# Altium schematic sheet 780-00012-P1, Sch M2 Focus Drive.SchDoc
size B; PageSetup: Record=PageOptions|CenterHorizontal=True|CenterVertical=True|PrintScale=1.09|XCorrection=1.00|YCorrection=1.00|PrintKind=0|BorderSize=5000000|LeftOffset=0|BottomOffset=0|Orientation=2|PaperLength=1000|PaperWidth=1000|Scale=100|PaperSource=7|PrintQuality=-4|MediaType=1|DitherType=10|PaperKind=Tabloid 11 x 17in|PrintScaleMode=1
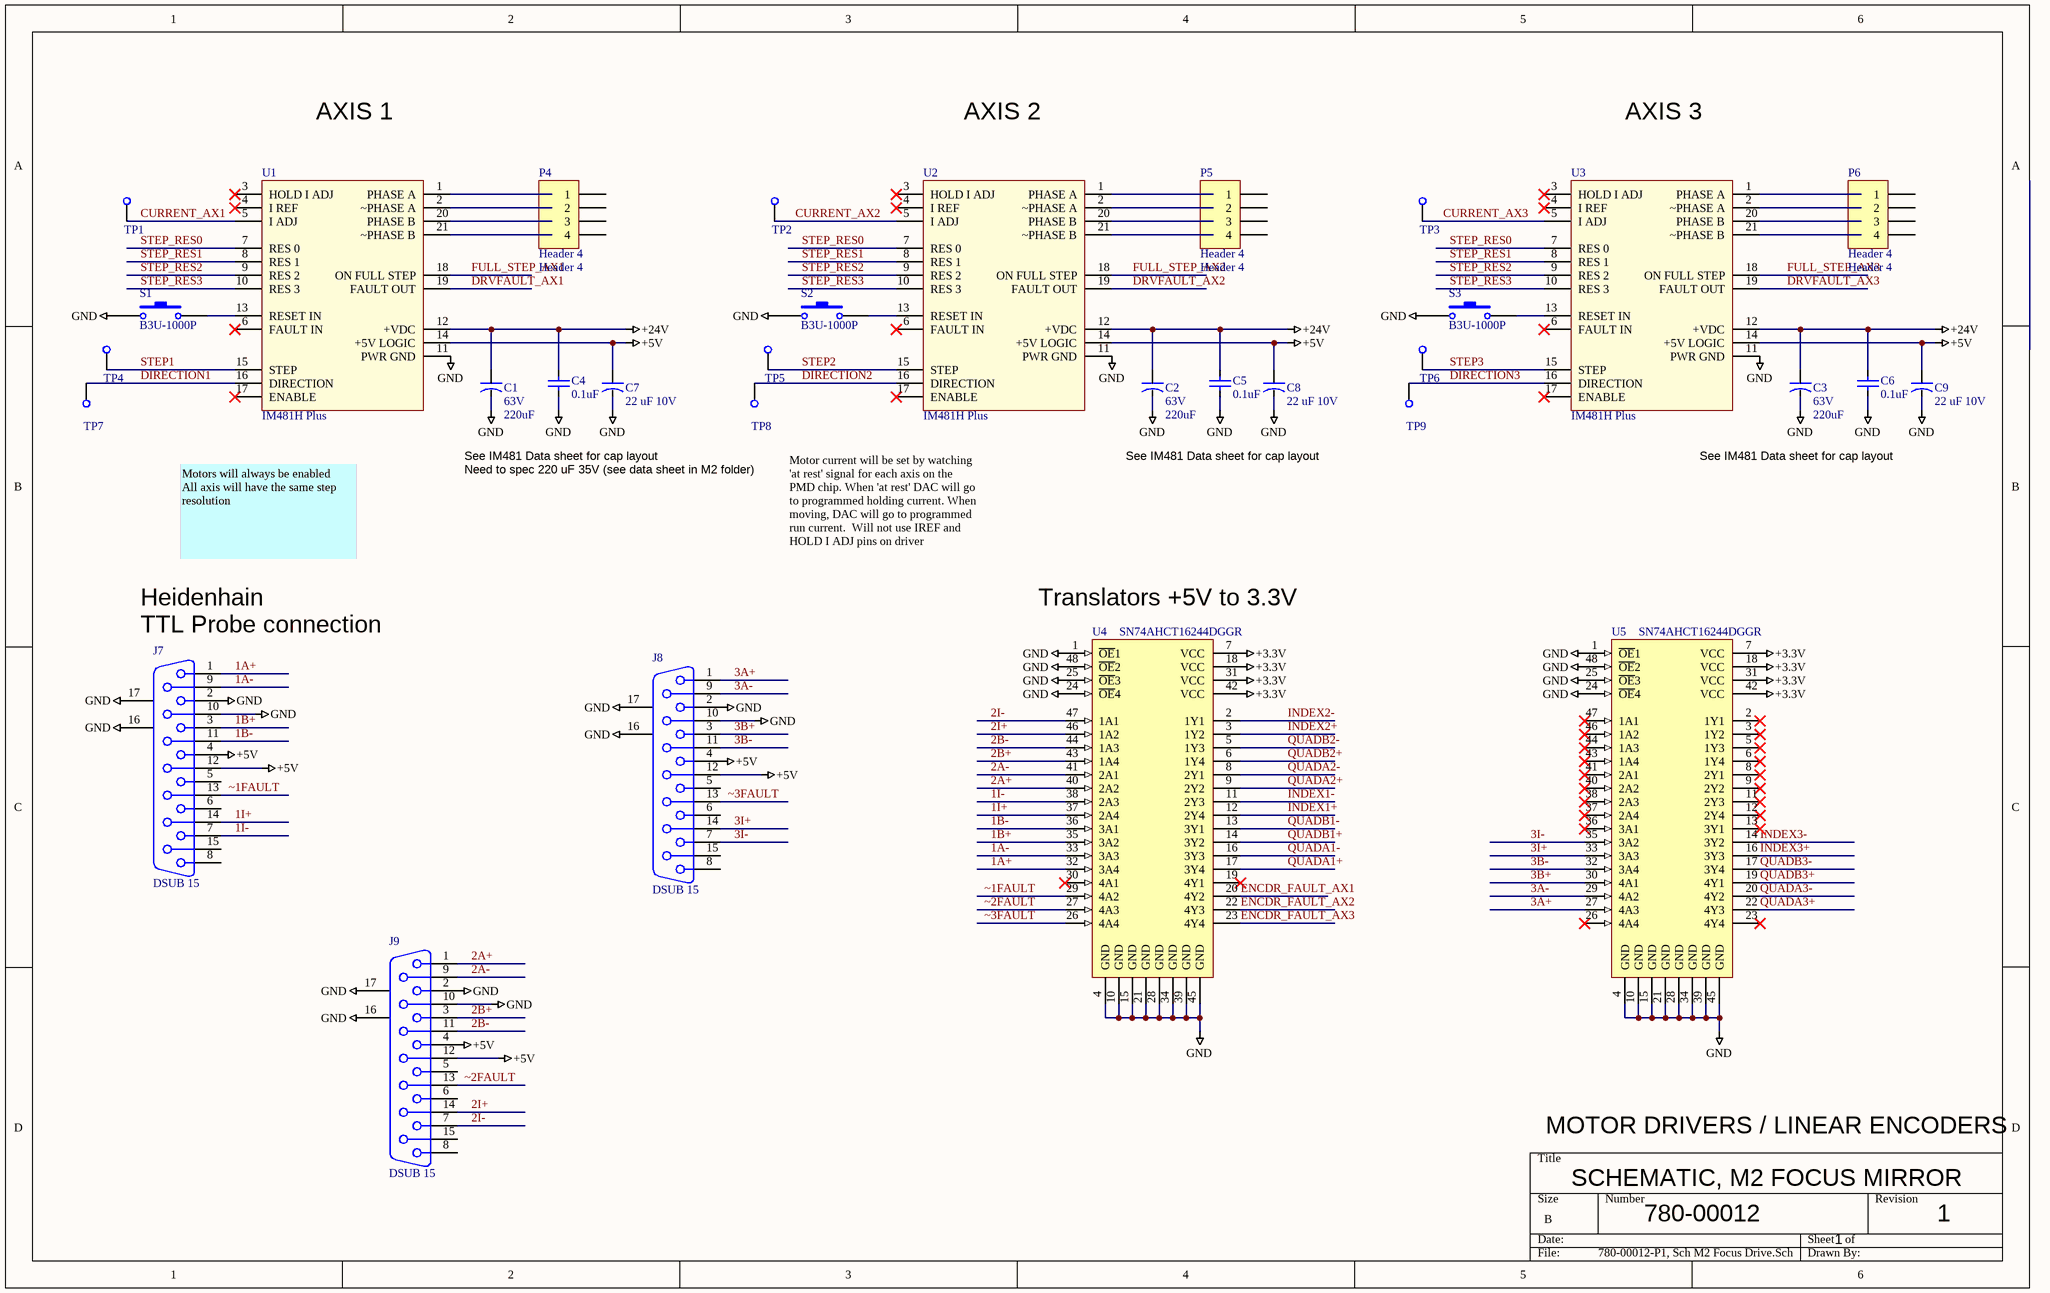
[diagram p0: 780-00012-P1, Sch M2 Focus Drive.SchDoc]

## Parts
C1  63V  value 220uF  [CAP 220uF 63V]
C2  63V  value 220uF  [CAP 220uF 63V]
C3  63V  value 220uF  [CAP 220uF 63V]
C4  value 0.1uF  [SMD_0805]  (hidden comment: Cap SMD)
C5  value 0.1uF  [SMD_0805]  (hidden comment: Cap SMD)
C6  value 0.1uF  [SMD_0805]  (hidden comment: Cap SMD)
C7  value 22 uF 10V  [SMD_CAP_3216]  (hidden comment: 16V)
C8  value 22 uF 10V  [SMD_CAP_3216]  (hidden comment: 16V)
C9  value 22 uF 10V  [SMD_CAP_3216]  (hidden comment: 16V)
J7  DSUB 15  [DSUB15 PCB VERT Female]
J8  DSUB 15  [DSUB15 PCB VERT Female]
J9  DSUB 15  [DSUB15 PCB VERT Female]
P4  Header 4  [HDR1X4 for IDC]
P5  Header 4  [HDR1X4 for IDC]
P6  Header 4  [HDR1X4 for IDC]
S1  B3U-1000P  [B3U-1000P]
S2  B3U-1000P  [B3U-1000P]
S3  B3U-1000P  [B3U-1000P]
TP1  Test Point SMD  [SMD_TEST POINT]  (value not drawn)
TP2  Test Point SMD  [SMD_TEST POINT]  (value not drawn)
TP3  Test Point SMD  [SMD_TEST POINT]  (value not drawn)
TP4  Test Point SMD  [SMD_TEST POINT]  (value not drawn)
TP5  Test Point SMD  [SMD_TEST POINT]  (value not drawn)
TP6  Test Point SMD  [SMD_TEST POINT]  (value not drawn)
TP7  Test Point SMD  [SMD_TEST POINT]  (value not drawn)
TP8  Test Point SMD  [SMD_TEST POINT]  (value not drawn)
TP9  Test Point SMD  [SMD_TEST POINT]  (value not drawn)
U1  IM481H Plus  [IM481H Vertical]
U2  IM481H Plus  [IM481H Vertical]
U3  IM481H Plus  [IM481H Vertical]
U4  SN74AHCT16244DGGR  [DGG048_N]
U5  SN74AHCT16244DGGR  [DGG048_N]

## Nets
+3.3V: U4.7(VCC) U4.18(VCC) U4.31(VCC) U4.42(VCC) U5.7(VCC) U5.18(VCC) U5.31(VCC) U5.42(VCC)
+5V: C7.1 C8.1 C9.1 J7.4 J7.12 J8.4 J8.12 J9.4 J9.12 U1.14(+5V_LOGIC) U2.14(+5V_LOGIC) U3.14(+5V_LOGIC)
+24V: C1.1 C2.1 C3.1 C4.2 C5.2 C6.2 U1.12(+VDC) U2.12(+VDC) U3.12(+VDC)
GND: C1.2 C2.2 C3.2 C4.1 C5.1 C6.1 C7.2 C8.2 C9.2 J7.2 J7.10 J7.16(MH1) J7.17(MH2) J8.2 J8.10 J8.16(MH1) J8.17(MH2) J9.2 J9.10 J9.16(MH1) J9.17(MH2) S1.1 S2.1 S3.1 U1.11(PWR_GND) U2.11(PWR_GND) U3.11(PWR_GND) U4.1(~{OE}1) U4.4(GND) U4.10(GND) U4.15(GND) U4.21(GND) U4.24(~{OE}4) U4.25(~{OE}3) U4.28(GND) U4.34(GND) U4.39(GND) U4.45(GND) U4.48(~{OE}2) U5.1(~{OE}1) U5.4(GND) U5.10(GND) U5.15(GND) U5.21(GND) U5.24(~{OE}4) U5.25(~{OE}3) U5.28(GND) U5.34(GND) U5.39(GND) U5.45(GND) U5.48(~{OE}2)
1A+: J7.1 U4.32(3A4)
1A-: J7.9 U4.33(3A3)
1B+: J7.3 U4.35(3A2)
1B-: J7.11 U4.36(3A1)
1I+: J7.14 U4.37(2A4)
1I-: J7.7 U4.38(2A3)
2A+: J9.1 U4.40(2A2)
2A-: J9.9 U4.41(2A1)
2B+: J9.3 U4.43(1A4)
2B-: J9.11 U4.44(1A3)
2I+: J9.14 U4.46(1A2)
2I-: J9.7 U4.47(1A1)
3A+: J8.1 U5.27(4A3)
3A-: J8.9 U5.29(4A2)
3B+: J8.3 U5.30(4A1)
3B-: J8.11 U5.32(3A4)
3I+: J8.14 U5.33(3A3)
3I-: J8.7 U5.35(3A2)
CURRENT_AX1: TP1.1(TP) U1.5(I_ADJ)
CURRENT_AX2: TP2.1(TP) U2.5(I_ADJ)
CURRENT_AX3: TP3.1(TP) U3.5(I_ADJ)
DIRECTION1: TP7.1(TP) U1.16(DIRECTION)
DIRECTION2: TP8.1(TP) U2.16(DIRECTION)
DIRECTION3: TP9.1(TP) U3.16(DIRECTION)
DRVFAULT_AX1: U1.19(FAULT_OUT)
DRVFAULT_AX2: U2.19(FAULT_OUT)
DRVFAULT_AX3: U3.19(FAULT_OUT)
ENCDR_FAULT_AX1: U4.20(4Y2)
ENCDR_FAULT_AX2: U4.22(4Y3)
ENCDR_FAULT_AX3: U4.23(4Y4)
FULL_STEP_AX1: U1.18(ON_FULL_STEP)
FULL_STEP_AX2: U2.18(ON_FULL_STEP)
FULL_STEP_AX3: U3.18(ON_FULL_STEP)
INDEX1+: U4.12(2Y4)
INDEX1-: U4.11(2Y3)
INDEX2+: U4.3(1Y2)
INDEX2-: U4.2(1Y1)
INDEX3+: U5.16(3Y3)
INDEX3-: U5.14(3Y2)
QUADA1+: U4.17(3Y4)
QUADA1-: U4.16(3Y3)
QUADA2+: U4.9(2Y2)
QUADA2-: U4.8(2Y1)
QUADA3+: U5.22(4Y3)
QUADA3-: U5.20(4Y2)
QUADB1+: U4.14(3Y2)
QUADB1-: U4.13(3Y1)
QUADB2+: U4.6(1Y4)
QUADB2-: U4.5(1Y3)
QUADB3+: U5.19(4Y1)
QUADB3-: U5.17(3Y4)
STEP1: TP4.1(TP) U1.15(STEP)
STEP2: TP5.1(TP) U2.15(STEP)
STEP3: TP6.1(TP) U3.15(STEP)
STEP_RES0: U1.7(RES_0) U2.7(RES_0) U3.7(RES_0)
STEP_RES1: U1.8(RES_1) U2.8(RES_1) U3.8(RES_1)
STEP_RES2: U1.9(RES_2) U2.9(RES_2) U3.9(RES_2)
STEP_RES3: U1.10(RES_3) U2.10(RES_3) U3.10(RES_3)
~1FAULT: J7.13 U4.29(4A2)
~2FAULT: J9.13 U4.27(4A3)
~3FAULT: J8.13 U4.26(4A4)
NetS1_2: S1.2 U1.13(RESET_IN)
NetS2_2: S2.2 U2.13(RESET_IN)
NetS3_2: S3.2 U3.13(RESET_IN)

Not connected (* = marked no-connect by the designer): J7 5 6 8 15; J8 5 6 8 15; J9 5 6 8 15; P4 1 2 3 4; P5 1 2 3 4; P6 1 2 3 4; U1 1(PHASE_A) 2(~PHASE_A) 3(HOLD_I_ADJ)* 4(I_REF)* 6(FAULT_IN)* 17(ENABLE)* 20(PHASE_B) 21(~PHASE_B); U2 1(PHASE_A) 2(~PHASE_A) 3(HOLD_I_ADJ)* 4(I_REF)* 6(FAULT_IN)* 17(ENABLE)* 20(PHASE_B) 21(~PHASE_B); U3 1(PHASE_A) 2(~PHASE_A) 3(HOLD_I_ADJ)* 4(I_REF)* 6(FAULT_IN)* 17(ENABLE)* 20(PHASE_B) 21(~PHASE_B); U4 19(4Y1)* 30(4A1)*; U5 2(1Y1)* 3(1Y2)* 5(1Y3)* 6(1Y4)* 8(2Y1)* 9(2Y2)* 11(2Y3)* 12(2Y4)* 13(3Y1)* 23(4Y4)* 26(4A4)* 36(3A1)* 37(2A4)* 38(2A3)* 40(2A2)* 41(2A1)* 43(1A4)* 44(1A3)* 46(1A2)* 47(1A1)*

## Notes on the sheet
- AXIS 1
- AXIS 2
- AXIS 3
- See IM481 Data sheet for cap layout
- Need to spec 220 uF 35V (see data sheet in M2 folder)
- Motors will always be enabled
  All axis will have the same step resolution
- Motor current will be set by watching 'at rest' signal for each axis on the PMD chip. When 'at rest' DAC will go to programmed holding current. When moving, DAC will go to programmed run current.  Will not use IREF and HOLD I ADJ pins on driver
- (near J7) TTL Probe connection
- Heidenhain
- (near U4) Translators +5V to 3.3V
- MOTOR DRIVERS / LINEAR ENCODERS
- SCHEMATIC, M2 FOCUS MIRROR
- 780-00012
- 1

## Library data of the parts
C1-C3 = Cap 220uF, 63V: CAP 220UF 63V ELECT MVH SMD; Manufacturer: United Chemi-Con; Manuf p/n: EMVH630ARA221MKG5S; Vendor: DigiKey; Vendor p/n: 565-2337-1-ND; Vendor Mult.: 5; LCO p/n: 120-00041; To Do list: New LCO pn; COST: 2.10
C4-C6 = Cap SMD: Capacitor; LCO p/n: 120-00002
C7-C9 = Cap Tant 16V: outline 3.2mm x 1.6mm; Manufacturer: KEMET; Manuf p/n: T494A106M016AT; Vendor: DIGIKEY; Vendor p/n: 399-3824-1-ND; Vendor Mult.: 1; LCO p/n: 120-00001; COST: 0.78
J7-J9 = DSUB 15: Receptacle Assembly, 15 Position; LCO p/n: 125-00038
P4-P6 = Header 4: Header, 4-Pin; LCO p/n: 125-00037; VALUE: Header 4
S1-S3 = SW-PB: Switch; Manufacturer: Omron Electronics; Vendor: DIGIKEY; Vendor Mult.: 1; Vendor p/n: SW1020CT-ND; Value: SW PB; LCO p/n: 185-00005; COST: 0.96; Manuf p/n: B3U-1000P
TP1-TP9 = Test Point SMD: SMD loop test point; LCO p/n: 160-00001; VALUE: Test Point SMD
U1-U3 = IM481H Plus: Hybrid stepper motor driver; LCO p/n: 170-00001; VALUE: IM481H
U4 U5 = SN74AHCT16244DGGR: 16-Bit Buffer/Driver with 3-State Outputs; LCO p/n: 150-00065